# Altium schematic sheet TPS62441RQRR.schdoc
size 127 x 101 mm
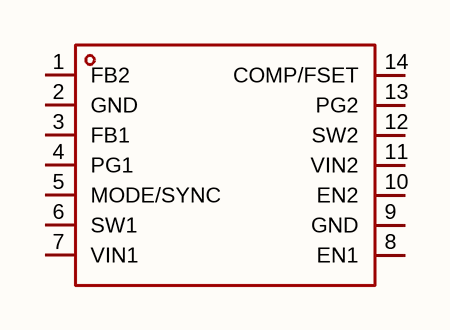
[diagram p0: TPS62441RQRR.schdoc]

## Parts
U?  tps62441rqrr  [VQFN-HR-14_L2.7-W2.3-P0.50-TL_TI_RQR0014A]  (value not drawn)

## Nets

Not connected (* = marked no-connect by the designer): U? 1(FB2) 2(GND) 3(FB1) 4(PG1) 5(MODE/SYNC) 6(SW1) 7(VIN1) 8(EN1) 9(GND) 10(EN2) 11(VIN2) 12(SW2) 13(PG2) 14(COMP/FSET)

## Library data of the parts
U? = tps62441rqrr: 功能类型:降压型;工作电压:2.75V~6V;输出电压:600mV~5.5V;输出电流:1A;输出类型:可调;; Manufacturer: TI(德州仪器); AddInBom: yes; ModelId: ee0c72c9e9064704ae621dbd677c3fc1; ModelTransform: 91.3384,107.0864,0,0,0,0,0,0,0; Function: 降压型; Output Current: 1A; Frequency - Switching: 1.8MHz~4MHz; Synchronous Rectifier: 是; Number of Outputs: 2; Topology: 降压式; Quiescent Current: 22uA; Switch tube (built-in/external): 内置; Output Type: 可调; Symbol: TPS62441RQRR; LCSC Part Name: 降压型 1A 2.75V~6V; SupplierPart: C20345981; ManufacturerPart: TPS62441RQRR; Supplier Footprint: VQFN-HR-14(2.3x2.7); JLCPCB Part Class: Extended Part; Datasheet: https://www.ti.com/lit/ds/symlink/tps62441.pdf; Supplier: LCSC; ConvertToPcb: yes; FootprintName: VQFN-HR-14_L2.7-W2.3-P0.50-TL_TI_RQR0014A; ModelName: VQFN-HR-14_L2.7-W2.3-P0.50-TL_TI_RQR0014A; Voltage - Supply: 2.75V~6V; Output Voltage: 600mV~5.5V; Operating Temperature: -40℃~+150℃; Features: 轻载高效模式；外部补偿；频率同步；过流保护；输出放电；EMI优化(抖频模式)；工作状态指示